# Altium project rgb_card.PrjPcb (part 4 of 4)

## Sheet modem.SchDoc
size A3
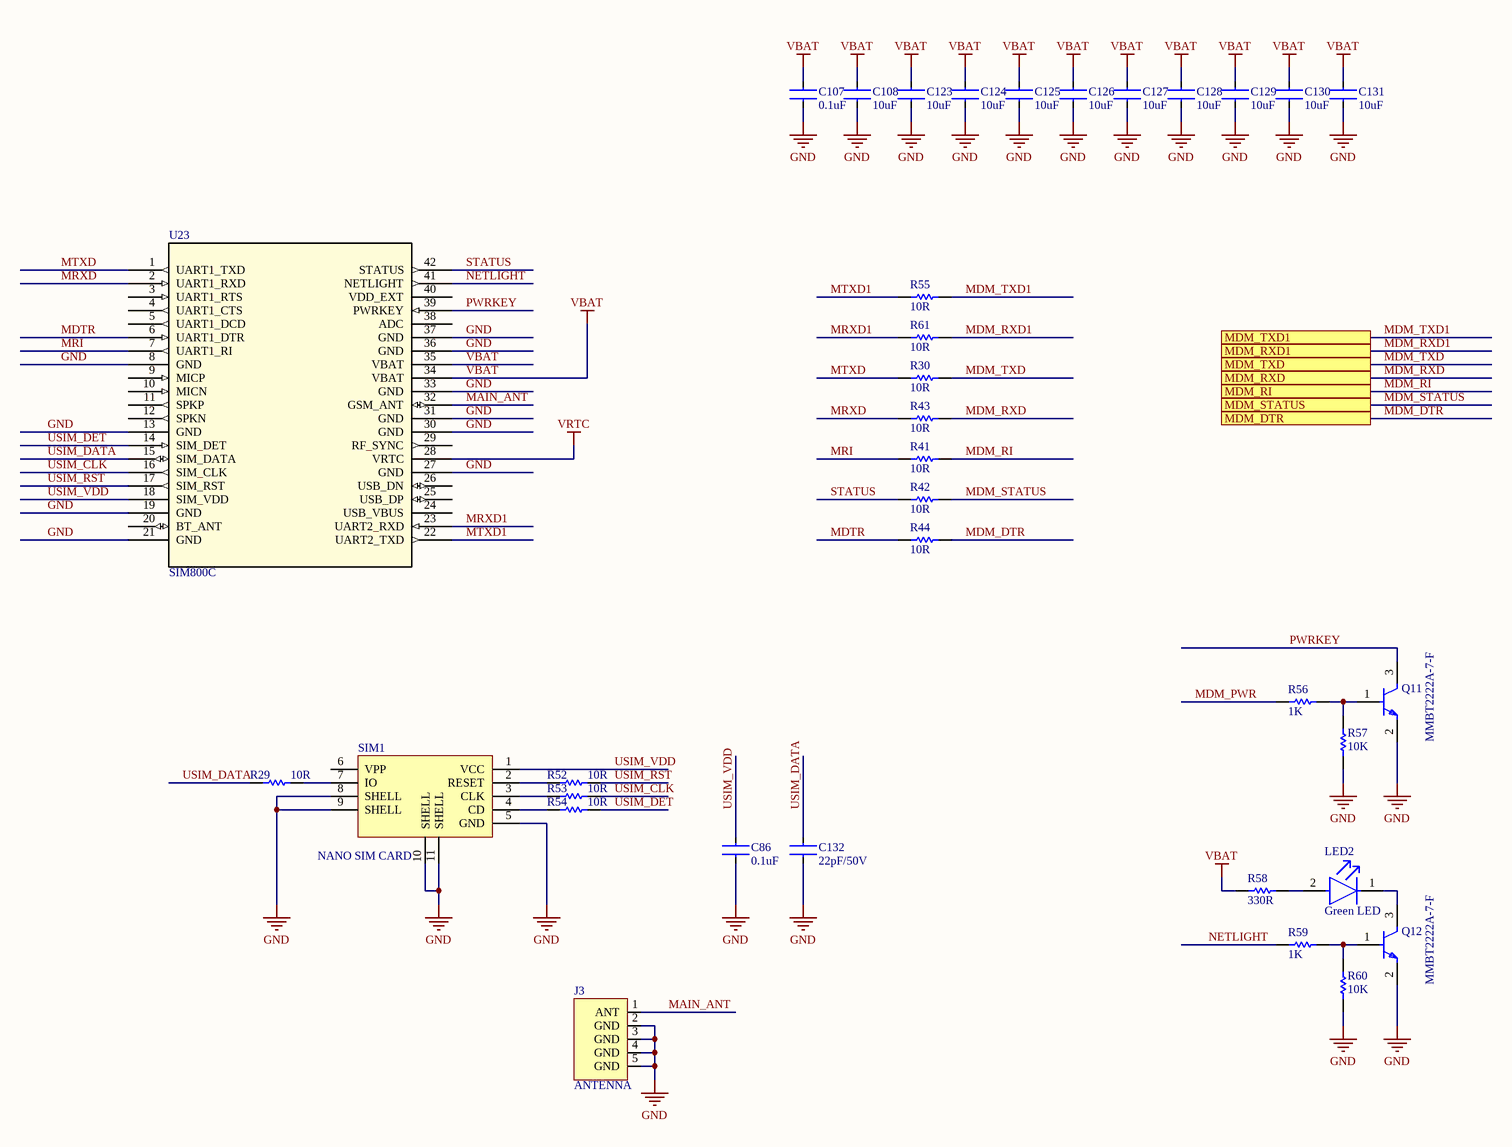
[diagram p11: modem.SchDoc]

### Parts
C86  0.1uF  [C0402]
C107  0.1uF  [C0402]
C108  10uF  [C0402]
C123  10uF  [C0402]
C124  10uF  [C0402]
C125  10uF  [C0402]
C126  10uF  [C0402]
C127  10uF  [C0402]
C128  10uF  [C0402]
C129  10uF  [C0402]
C130  10uF  [C0402]
C131  10uF  [C0402]
C132  22pF/50V  [C0402]
J3  ANTENNA  [Antenna]
LED2  Green LED  [SMD_LED_1206]
Q11  MMBT2222A-7-F  [SOT-23-3L_AOS]
Q12  MMBT2222A-7-F  [SOT-23-3L_AOS]
R29  10R  [R0402]
R30  10R  [R0402]
R41  10R  [R0402]
R42  10R  [R0402]
R43  10R  [R0402]
R44  10R  [R0402]
R52  10R  [R0402]
R53  10R  [R0402]
R54  10R  [R0402]
R55  10R  [R0402]
R56  1K  [R0402]
R57  10K  [R0402]
R58  330R  [R0402]
R59  1K  [R0402]
R60  10K  [R0402]
R61  10R  [R0402]
SIM1  NANO SIM CARD  [Nano Sim]
U23  SIM800C  [SIM800C_SMM]

### Ports
MDM_DTR, MDM_RI, MDM_RXD, MDM_RXD1, MDM_STATUS, MDM_TXD, MDM_TXD1

### Nets
GND: C86.2 C107.2 C108.2 C123.2 C124.2 C125.2 C126.2 C127.2 C128.2 C129.2 C130.2 C131.2 C132.2 J3.2(GND) J3.3(GND) J3.4(GND) J3.5(GND) Q11.2(E) Q12.2(E) R57.1 R60.1 SIM1.5(GND) SIM1.8(SHELL) SIM1.9(SHELL) SIM1.10(SHELL) SIM1.11(SHELL) U23.8(GND) U23.13(GND) U23.19(GND) U23.21(GND) U23.27(GND) U23.30(GND) U23.31(GND) U23.33(GND) U23.36(GND) U23.37(GND)
VBAT: C107.1 C108.1 C123.1 C124.1 C125.1 C126.1 C127.1 C128.1 C129.1 C130.1 C131.1 R58.1 U23.34(VBAT) U23.35(VBAT)
VRTC: U23.28(VRTC)
MAIN_ANT: J3.1(ANT) U23.32(GSM_ANT)
MDM_DTR: R44.2 ; port MDM_DTR
MDM_PWR: R56.1
MDM_RI: R41.2 ; port MDM_RI
MDM_RXD: R43.2 ; port MDM_RXD
MDM_RXD1: R61.2 ; port MDM_RXD1
MDM_STATUS: R42.2 ; port MDM_STATUS
MDM_TXD: R30.2 ; port MDM_TXD
MDM_TXD1: R55.2 ; port MDM_TXD1
MDTR: R44.1 U23.6(UART1_DTR)
MRI: R41.1 U23.7(UART1_RI)
MRXD: R43.1 U23.2(UART1_RXD)
MRXD1: R61.1 U23.23(UART2_RXD)
MTXD: R30.1 U23.1(UART1_TXD)
MTXD1: R55.1 U23.22(UART2_TXD)
NETLIGHT: R59.1 U23.41(NETLIGHT)
PWRKEY: Q11.3(C) U23.39(PWRKEY)
STATUS: R42.1 U23.42(STATUS)
USIM_CLK: R53.2 U23.16(SIM_CLK)
USIM_DATA: C132.1 R29.1 U23.15(SIM_DATA)
USIM_DET: R54.2 U23.14(SIM_DET)
USIM_RST: R52.2 U23.17(SIM_RST)
USIM_VDD: C86.1 SIM1.1(VCC) U23.18(SIM_VDD)
NetLED2_1: LED2.1(C) Q12.3(C)
NetLED2_2: LED2.2(A) R58.2
NetQ11_1: Q11.1(B) R56.2 R57.2
NetQ12_1: Q12.1(B) R59.2 R60.2
NetR29_2: R29.2 SIM1.7(IO)
NetR52_1: R52.1 SIM1.2(RESET)
NetR53_1: R53.1 SIM1.3(CLK)
NetR54_1: R54.1 SIM1.4(CD)

Not connected (* = marked no-connect by the designer): SIM1 6(VPP); U23 3(UART1_RTS) 4(UART1_CTS) 5(UART1_DCD) 9(MICP) 10(MICN) 11(SPKP) 12(SPKN) 20(BT_ANT) 24(USB_VBUS) 25(USB_DP) 26(USB_DN) 29(RF_SYNC) 38(ADC) 40(VDD_EXT)

### Library data of the parts
C86 C107 = CL31B104KBCNNNC: Ceramic capacitor SMD-1206 100nF /50V X7R# K +-10%, Samsung, RoHS; Tolerance: 10%; Dielectric: X7R; Voltage: 50V; Supplier 1: Arrow Electronics; Manufacturer: Samsung; Manufacturer Part Number: CL31B104KBCNNNC; RoHS: Yes; Category: Ceramic Capacitors; Stock 1: 3508000; Pricing 1: 4000=0.02060, 8000=0.01660 (USD); Mount: Surface Mount; Case/Package: 1206; Case Code (Metric): 3216; Case Code (Imperial): 1206; Material: Ceramic; Contact Plating: Tin; Min Operating Temperature: -55°C; Max Operating Temperature: 125°C; Capacitance: 100nF; Voltage Rating (DC): 50V; Packaging: Tape and Reel; Voltage Rating: 50V; Series: CL; Length: 3.2mm; Width: 0.063inch; Height: 0.85mm; Depth: 1.6mm; Thickness: 0.037inch; Radiation Hardening: No; Lead Free: Lead Free; RoHS Compliant: Yes; ComponentLink1URL: https://datasheet.ciiva.com/25710/cl31b104kbcnnnc-25710293.pdf?src-supplier=Digi-Key; ComponentLink1Description: https://datasheet.ciiva.com/25710/cl31b104kbcnnnc-25710293.pdf?src-supplier=Digi-Key; ComponentLink2URL: https://datasheet.ciiva.com/29201/451941-da-01-en-vs-kondensator-1206-29201689.pdf?src-supplier=Conrad; ComponentLink2Description: https://datasheet.ciiva.com/29201/451941-da-01-en-vs-kondensator-1206-29201689.pdf?src-supplier=Conrad; ComponentLink3URL: https://datasheet.ciiva.com/16298/cl05b104kq5nnnc-16298186.pdf?src-supplier=Future+Electronics; ComponentLink3Description: https://datasheet.ciiva.com/16298/cl05b104kq5nnnc-16298186.pdf?src-supplier=Future+Electronics; Supplier Part Number 1: CL31B104KBCNNNC
C108 C123-C131 = CL31B106KOHNNNE: Cap Ceramic 10uF 16V X7R 10% Pad SMD 1206 125°C T/R; Manufacturer: Samsung; Supplier 1: Future Electronics; Manufacturer Part Number: CL31B106KOHNNNE; RoHS: Yes; Category: Ceramic Capacitors; Stock 1: 116000; Pricing 1: 2000=0.03800, 6000=0.03460, 8000=0.03450, 20000=0.03420, 30000=0.03400 (USD); Mount: Surface Mount; Case/Package: 1206; Case Code (Metric): 3216; Case Code (Imperial): 1206; Material: Ceramic; Contact Plating: Tin; Min Operating Temperature: -55°C; Max Operating Temperature: 125°C; Capacitance: 10uF; Tolerance: 10%; Dielectric: X7R; Package Quantity: 1; Packaging: Tape and Reel; Voltage Rating: 16V; Series: CL; Length: 3.2mm; Width: 0.063inch; Height: 1.6mm; Thickness: 0.071inch; Depth: 1.6mm; RoHS Compliant: Yes; ComponentLink1URL: https://datasheet.ciiva.com/25795/cl31b106kohnnne-25795201.pdf?src-supplier=Digi-Key; ComponentLink1Description: https://datasheet.ciiva.com/25795/cl31b106kohnnne-25795201.pdf?src-supplier=Digi-Key; ComponentLink2URL: https://datasheet.ciiva.com/29201/452535-da-01-en-vs-kondensator-1206-29201132.pdf?src-supplier=Conrad; ComponentLink2Description: https://datasheet.ciiva.com/29201/452535-da-01-en-vs-kondensator-1206-29201132.pdf?src-supplier=Conrad; Supplier Part Number 1: 2558872
C132 = CL31C220JBCNNNC: Cap Ceramic 22pF 50V C0G 5% SMD 1206 125°C Paper T/R; Manufacturer: Samsung; Temperature Coefficient: 300ppm/°C; Supplier 1: Arrow Electronics; Manufacturer Part Number: CL31C220JBCNNNC; RoHS: Yes; Category: Ceramic Capacitors; Stock 1: 470; Pricing 1: 1=0.13340, 10=0.08580, 25=0.08490, 100=0.04720, 250=0.04670 (USD); Mount: Surface Mount; Case/Package: 1206; Case Code (Metric): 3216; Case Code (Imperial): 1206; Material: Ceramic; Min Operating Temperature: -55°C; Max Operating Temperature: 125°C; Capacitance: 22pF; Tolerance: 5%; Dielectric: C0G; Voltage Rating: 50V; Package Quantity: 1; Packaging: Tape and Reel; Voltage: 50V; Voltage Rating (DC): 50V; Series: CL; Construction: Flat; Length: 3.2mm; Width: 0.063inch; Height: 0.85mm; Depth: 1.6mm; Thickness: 0.039inch; Radiation Hardening: No; Lead Free: Lead Free; RoHS Compliant: Yes; ComponentLink1URL: https://datasheet.ciiva.com/25799/cl31c220jbcnnnc-25799089.pdf?src-supplier=Digi-Key; ComponentLink1Description: https://datasheet.ciiva.com/25799/cl31c220jbcnnnc-25799089.pdf?src-supplier=Digi-Key; ComponentLink2URL: https://datasheet.ciiva.com/29201/452314-da-01-en-vs-kondensator-1206-29201377.pdf?src-supplier=Conrad; ComponentLink2Description: https://datasheet.ciiva.com/29201/452314-da-01-en-vs-kondensator-1206-29201377.pdf?src-supplier=Conrad; Supplier Part Number 1: CL31C220JBCNNNC
LED2 = LTST-C150GKT: LED GREEN CLEAR 1206 SMD; Manufacturer: Vishay Lite-On; Lens Color: Colorless; Lens Style: Diffused,Colorless,Rectangular,Clear; Number of LEDs: 1; Luminous Intensity: 6mcd; Forward Voltage: 2.1V; Test Current: 10mA; Wavelength: 565nm; Reverse Voltage: 5V; Forward Current: 30mA; Viewing Angle: 130°; Power Rating: 100mW; Dominant Wavelength: 569nm; Supplier 1: Rutronik; Manufacturer Part Number: LTST-C150GKT; RoHS: Yes; Category: LEDs; Stock 1: 5; Pricing 1: 9000=0.04160, 18000=0.04120, 27000=0.04120 (USD); Mount: Surface Mount; Case/Package: 1206; Number of Pins: 2; Color: Green; Case Code (Metric): 3216; Case Code (Imperial): 1206; Min Operating Temperature: -55°C; Max Operating Temperature: 85°C; Packaging: Tape and Reel; Package Quantity: 1; Illumination Color: Green; Lens Transparency: Clear; Number of Elements: 1; Power Dissipation: 100mW; Series: CHIPLED 1206; Max Power Dissipation: 100mW; Length: 3.2mm; Width: 1.6mm; Height: 1.1mm; Depth: 1.6mm; Radiation Hardening: No; Lead Free: Lead Free; RoHS Compliant: Yes; ComponentLink1URL: https://datasheet.ciiva.com/2110/ltst-c150gkt-2110032.pdf?src-supplier=Digi-Key; ComponentLink1Description: https://datasheet.ciiva.com/2110/ltst-c150gkt-2110032.pdf?src-supplier=Digi-Key; ComponentLink2URL: https://datasheet.ciiva.com/11775/0900766b80dc0263-11775637.pdf?src-supplier=RSComponents; ComponentLink2Description: https://datasheet.ciiva.com/11775/0900766b80dc0263-11775637.pdf?src-supplier=RSComponents; ComponentLink3URL: https://datasheet.ciiva.com/12400/lite-on-ltst-c150gkt-187412-12400912.pdf?src-supplier=Mouser; ComponentLink3Description: https://datasheet.ciiva.com/12400/lite-on-ltst-c150gkt-187412-12400912.pdf?src-supplier=Mouser; ComponentLink4URL: https://datasheet.ciiva.com/4266/s-110-ltst-c150gkt-4266310.pdf?src-supplier=Arrow+Electronics; ComponentLink4Description: https://datasheet.ciiva.com/4266/s-110-ltst-c150gkt-4266310.pdf?src-supplier=Arrow+Electronics; ComponentLink5URL: https://datasheet.ciiva.com/16375/ltst-c150gkt-16375926.pdf?src-supplier=Future+Electronics; ComponentLink5Description: https://datasheet.ciiva.com/16375/ltst-c150gkt-16375926.pdf?src-supplier=Future+Electronics; ComponentLink6URL: https://datasheet.ciiva.com/15117/getdatasheetpartid-142080-15117739.pdf?src-supplier=Verical; ComponentLink6Description: https://datasheet.ciiva.com/15117/getdatasheetpartid-142080-15117739.pdf?src-supplier=Verical; Supplier Part Number 1: LED6762
Q11 Q12 = MMBT2222A-7-F: NPN Ic=600mA Vceo=40V hfe=100~300 fT=300MHz P=310mW SOT-23; Manufacturer: Diodes; hFE Min: 100; Frequency: 300MHz; Max Power Dissipation: 300mW; Number of Elements: 1; Collector Emitter Voltage (VCEO): 40V; Collector Base Voltage (VCBO): 75V; Emitter Base Voltage (VEBO): 6V; Collector Emitter Saturation Voltage: 1V; Max Collector Current: 600mA; Power Dissipation: 350mW; Element Configuration: Single; Current: 1A; Supplier 1: RSComponents; Manufacturer Part Number: MMBT2222A-7-F; RoHS: Yes; Category: BJTs; Stock 1: 3000; Pricing 1: 3000=0.02700, 6000=0.02500, 12000=0.02400, 30000=0.02300, 60000=0.02100 (USD); Mount: Surface Mount; Case/Package: SOT-23; Number of Pins: 3; Weight: 0.000282oz; Contact Plating: Tin,Matte; Min Operating Temperature: -55°C; Max Operating Temperature: 150°C; Polarity: NPN; Packaging: Tape and Reel; Package Quantity: 3000; Continuous Collector Current: 600mA; Collector Emitter Breakdown Voltage: 40V; Transition Frequency: 300MHz; Max Breakdown Voltage: 40V; Max Frequency: 300MHz; Termination: SMD/SMT; Gain Bandwidth Product: 300MHz; Voltage Rating (DC): 40V; Current Rating: 600mA; Voltage: 40V; Collector-emitter Voltage-Max: 1V; Series: -; Length: 3.05mm; Width: 1.4mm; Height: 1mm; Radiation Hardening: No; REACH SVHC: No SVHC; Lead Free: Lead Free; RoHS Compliant: Yes; ComponentLink1URL: https://datasheet.ciiva.com/15139/getdatasheetpartid-82692-15139078.pdf?src-supplier=Verical; ComponentLink1Description: https://datasheet.ciiva.com/15139/getdatasheetpartid-82692-15139078.pdf?src-supplier=Verical; ComponentLink2URL: https://datasheet.ciiva.com/8029/ds30041-8029709.pdf?src-supplier=Element14; ComponentLink2Description: https://datasheet.ciiva.com/8029/ds30041-8029709.pdf?src-supplier=Element14; ComponentLink3URL: https://datasheet.ciiva.com/11201/ds30041-11201864.pdf?src-supplier=Avnet; ComponentLink3Description: https://datasheet.ciiva.com/11201/ds30041-11201864.pdf?src-supplier=Avnet; ComponentLink4URL: https://datasheet.ciiva.com/16199/ds30041-16199045.pdf?src-supplier=Future+Electronics; ComponentLink4Description: https://datasheet.ciiva.com/16199/ds30041-16199045.pdf?src-supplier=Future+Electronics; ComponentLink5URL: https://datasheet.ciiva.com/11198/ds30041-11198965.pdf?src-supplier=Avnet; ComponentLink5Description: https://datasheet.ciiva.com/11198/ds30041-11198965.pdf?src-supplier=Avnet; ComponentLink6URL: https://datasheet.ciiva.com/972/ds30041-972551.pdf?src-supplier=Digi-Key; ComponentLink6Description: https://datasheet.ciiva.com/972/ds30041-972551.pdf?src-supplier=Digi-Key; ComponentLink7URL: https://datasheet.ciiva.com/972/ds30041-972552.pdf?src-supplier=Digi-Key; ComponentLink7Description: https://datasheet.ciiva.com/972/ds30041-972552.pdf?src-supplier=Digi-Key; ComponentLink8URL: https://datasheet.ciiva.com/972/ds30041-972550.pdf?src-supplier=Digi-Key; ComponentLink8Description: https://datasheet.ciiva.com/972/ds30041-972550.pdf?src-supplier=Digi-Key; Supplier Part Number 1: 1219442
R29 R30 R41-R44 R52-R55 R61 = RC1206FR-0710RL: Res Thick Film 1206 10 Ohm 1% 0.25W(1/4W) +/-200ppm/ßC Epoxy SMD T/R; Manufacturer: Yageo; Temperature Coefficient: 200ppm/°C; Voltage Rating (DC): 200V; Power Rating: 250mW; Supplier 1: Arrow Electronics; Manufacturer Part Number: RC1206FR-0710RL; RoHS: Yes; Category: Chip SMD Resistors; Stock 1: 60000; Pricing 1: 5000=0.02280 (USD); Case/Package: 1206; Number of Pins: 2; Case Code (Metric): 3216; Case Code (Imperial): 1206; Size Code: 1206; Min Operating Temperature: -55°C; Max Operating Temperature: 155°C; Tolerance: 1%; Resistance: 10R; Resistor Type: Thick Film; Packaging: Tape and Reel; Package Quantity: 1; Voltage Rating: 200V; Number of Terminations: 2; Termination: SMD/SMT; Max Power Dissipation: 250mW; Features: Moisture Resistant; Series: RC; Resistance Tolerance: 1%; Technology: THICK FILM; Construction: Rectangular; Length: 3.1mm; Width: 0.063inch; Height: 0.026inch; Depth: 1.6mm; REACH SVHC: Unknown; Lead Free: Lead Free; Military Standard: Not; RoHS Compliant: Yes; ComponentLink1URL: https://datasheet.ciiva.com/11819/0900766b80c6630a-11819896.pdf?src-supplier=RSComponents; ComponentLink1Description: https://datasheet.ciiva.com/11819/0900766b80c6630a-11819896.pdf?src-supplier=RSComponents; ComponentLink2URL: https://datasheet.ciiva.com/22735/444357-22735648.pdf?src-supplier=Farnell; ComponentLink2Description: https://datasheet.ciiva.com/22735/444357-22735648.pdf?src-supplier=Farnell; ComponentLink3URL: https://datasheet.ciiva.com/29181/402303-da-01-en-smd-widerstand-chip1206-10-ohm-29181572.pdf?src-supplier=Conrad; ComponentLink3Description: https://datasheet.ciiva.com/29181/402303-da-01-en-smd-widerstand-chip1206-10-ohm-29181572.pdf?src-supplier=Conrad; ComponentLink4URL: https://datasheet.ciiva.com/46445/444357-46445704.pdf?src-supplier=Element14; ComponentLink4Description: https://datasheet.ciiva.com/46445/444357-46445704.pdf?src-supplier=Element14; ComponentLink5URL: https://datasheet.ciiva.com/2460/pyu-rc1206-51-rohs-l-4-2460049.pdf?src-supplier=Digi-Key; ComponentLink5Description: https://datasheet.ciiva.com/2460/pyu-rc1206-51-rohs-l-4-2460049.pdf?src-supplier=Digi-Key; ComponentLink6URL: https://datasheet.ciiva.com/2460/pyu-rc1206-51-rohs-l-4-2460050.pdf?src-supplier=Digi-Key; ComponentLink6Description: https://datasheet.ciiva.com/2460/pyu-rc1206-51-rohs-l-4-2460050.pdf?src-supplier=Digi-Key; ComponentLink7URL: https://datasheet.ciiva.com/2460/pyu-rc1206-51-rohs-l-4-2460048.pdf?src-supplier=Digi-Key; ComponentLink7Description: https://datasheet.ciiva.com/2460/pyu-rc1206-51-rohs-l-4-2460048.pdf?src-supplier=Digi-Key; ComponentLink8URL: https://datasheet.ciiva.com/16962/pyu-rc1206-51-rohs-l-4-16962857.pdf?src-supplier=Future+Electronics; ComponentLink8Description: https://datasheet.ciiva.com/16962/pyu-rc1206-51-rohs-l-4-16962857.pdf?src-supplier=Future+Electronics; Supplier Part Number 1: RC1206FR-0710RL
R56 R59 = RC1206FR-071KL: In a Pack of 5000, 1K 1206 Thick Film SMD Resistor ±1% 0.25W - RC1206FR-071KL; Manufacturer: Yageo; Resistance: 1kR; Power Rating: 250mW; Voltage Rating: 200V; Temperature Coefficient: 100ppm/°C; Supplier 1: Arrow Electronics; Manufacturer Part Number: RC1206FR-071KL; RoHS: Yes; Category: Chip SMD Resistors; Stock 1: 535000; Pricing 1: 5000=0.00940, 10000=0.00890 (USD); Case/Package: 1206; Case Code (Imperial): 1206; Case Code (Metric): 3216; Size Code: 1206; Min Operating Temperature: -55°C; Max Operating Temperature: 155°C; Tolerance: 1%; Packaging: Tape and Reel; Resistor Type: Thick Film; Termination: SMD/SMT; Series: RC; Resistance Tolerance: 1%; Construction: Rectangular; Technology: THICK FILM; Length: 3.1mm; Height: 0.55mm; Depth: 1.6mm; REACH SVHC: Unknown; Military Standard: Not; Lead Free: Lead Free; RoHS Compliant: Yes; ComponentLink1URL: https://datasheet.ciiva.com/11808/0900766b80c6630a-11808217.pdf?src-supplier=RSComponents; ComponentLink1Description: https://datasheet.ciiva.com/11808/0900766b80c6630a-11808217.pdf?src-supplier=RSComponents; ComponentLink2URL: https://datasheet.ciiva.com/29181/402540-da-01-en-smd-widerstand-chip1206-1-kohm-29181462.pdf?src-supplier=Conrad; ComponentLink2Description: https://datasheet.ciiva.com/29181/402540-da-01-en-smd-widerstand-chip1206-1-kohm-29181462.pdf?src-supplier=Conrad; ComponentLink3URL: https://datasheet.ciiva.com/46445/444357-46445708.pdf?src-supplier=Element14; ComponentLink3Description: https://datasheet.ciiva.com/46445/444357-46445708.pdf?src-supplier=Element14; Supplier Part Number 1: RC1206FR-071KL
R57 R60 = RC1206FR-0710KL: Res Thick Film 1206 10K Ohm 1% 0.25W(1/4W) ±100ppm/C Pad SMD T/R; Manufacturer: Yageo; Resistance: 10kR; Temperature Coefficient: 100ppm/°C; Power Rating: 250mW; Voltage Rating: 200V; Supplier 1: Arrow Electronics; Manufacturer Part Number: RC1206FR-0710KL; RoHS: Yes; Category: Chip SMD Resistors; Stock 1: 10000; Pricing 1: 5000=0.00970 (USD); Case/Package: 1206; Case Code (Imperial): 1206; Case Code (Metric): 3216; Size Code: 1206; Min Operating Temperature: -55°C; Max Operating Temperature: 155°C; Tolerance: 1%; Packaging: Tape and Reel; Resistor Type: Thick Film; Package Quantity: 5000; Termination: SMD/SMT; Features: Moisture Resistant; Series: RC; Max Power Dissipation: 250mW; Number of Terminations: 2; Resistance Tolerance: 1%; Construction: Rectangular; Length: 3.1mm; Width: 1.6mm; Height: 0.55mm; Depth: 1.6mm; REACH SVHC: Unknown; Lead Free: Lead Free; Military Standard: Not; RoHS Compliant: Yes; ComponentLink1URL: https://datasheet.ciiva.com/46445/444357-46445703.pdf?src-supplier=Element14; ComponentLink1Description: https://datasheet.ciiva.com/46445/444357-46445703.pdf?src-supplier=Element14; ComponentLink2URL: https://datasheet.ciiva.com/7857/1692832-7857244.pdf?src-supplier=Element14; ComponentLink2Description: https://datasheet.ciiva.com/7857/1692832-7857244.pdf?src-supplier=Element14; ComponentLink3URL: https://datasheet.ciiva.com/7857/1692832-7857245.pdf?src-supplier=Element14; ComponentLink3Description: https://datasheet.ciiva.com/7857/1692832-7857245.pdf?src-supplier=Element14; Supplier Part Number 1: RC1206FR-0710KL
R58 = RC1206FR-07330RL: Res Thick Film 1206 330 Ohm 1% 0.25W(1/4W) ±100ppm/°C Pad SMD T/R; Manufacturer: Yageo; Power Rating: 250mW; Voltage Rating: 200V; Supplier 1: Arrow Electronics; Manufacturer Part Number: RC1206FR-07330RL; RoHS: Yes; Category: Chip SMD Resistors; Stock 1: 4745; Pricing 1: 1=0.07520, 10=0.04740, 25=0.04700, 100=0.02480, 250=0.02450, 500=0.02430, 1000=0.02280, 3000=0.01110 (USD); Case/Package: 1206; Case Code (Imperial): 1206; Case Code (Metric): 3216; Size Code: 1206; Min Operating Temperature: -55°C; Max Operating Temperature: 155°C; Tolerance: 1%; Resistance: 330R; Resistor Type: Thick Film; Packaging: Tape and Reel; Termination: SMD/SMT; Temperature Coefficient: 100ppm/°C; Features: Moisture Resistant; Series: RC; Max Power Dissipation: 250mW; Number of Terminations: 2; Technology: THICK FILM; Resistance Tolerance: 1%; Length: 3.1mm; Height: 0.55mm; Depth: 1.6mm; RoHS Compliant: Yes; REACH SVHC: Unknown; Lead Free: Lead Free; ComponentLink1URL: https://datasheet.ciiva.com/11819/0900766b80c6630a-11819921.pdf?src-supplier=RSComponents; ComponentLink1Description: https://datasheet.ciiva.com/11819/0900766b80c6630a-11819921.pdf?src-supplier=RSComponents; ComponentLink2URL: https://datasheet.ciiva.com/17422/pyu-rc1206-51-rohs-l-4-17422588.pdf?src-supplier=Future+Electronics; ComponentLink2Description: https://datasheet.ciiva.com/17422/pyu-rc1206-51-rohs-l-4-17422588.pdf?src-supplier=Future+Electronics; Supplier Part Number 1: RC1206FR-07330RL
SIM1 = Nano sim
U23 = SIM800C: No Description Available; Mfr_Name: Simcom; Copyright: Copyright (C) 2022 Ultra Librarian. All rights reserved.; Manufacturer_Part_Number: SIM800C; RefDes: RefDes; Type: DEV

## Sheet ethernet.SchDoc
size A
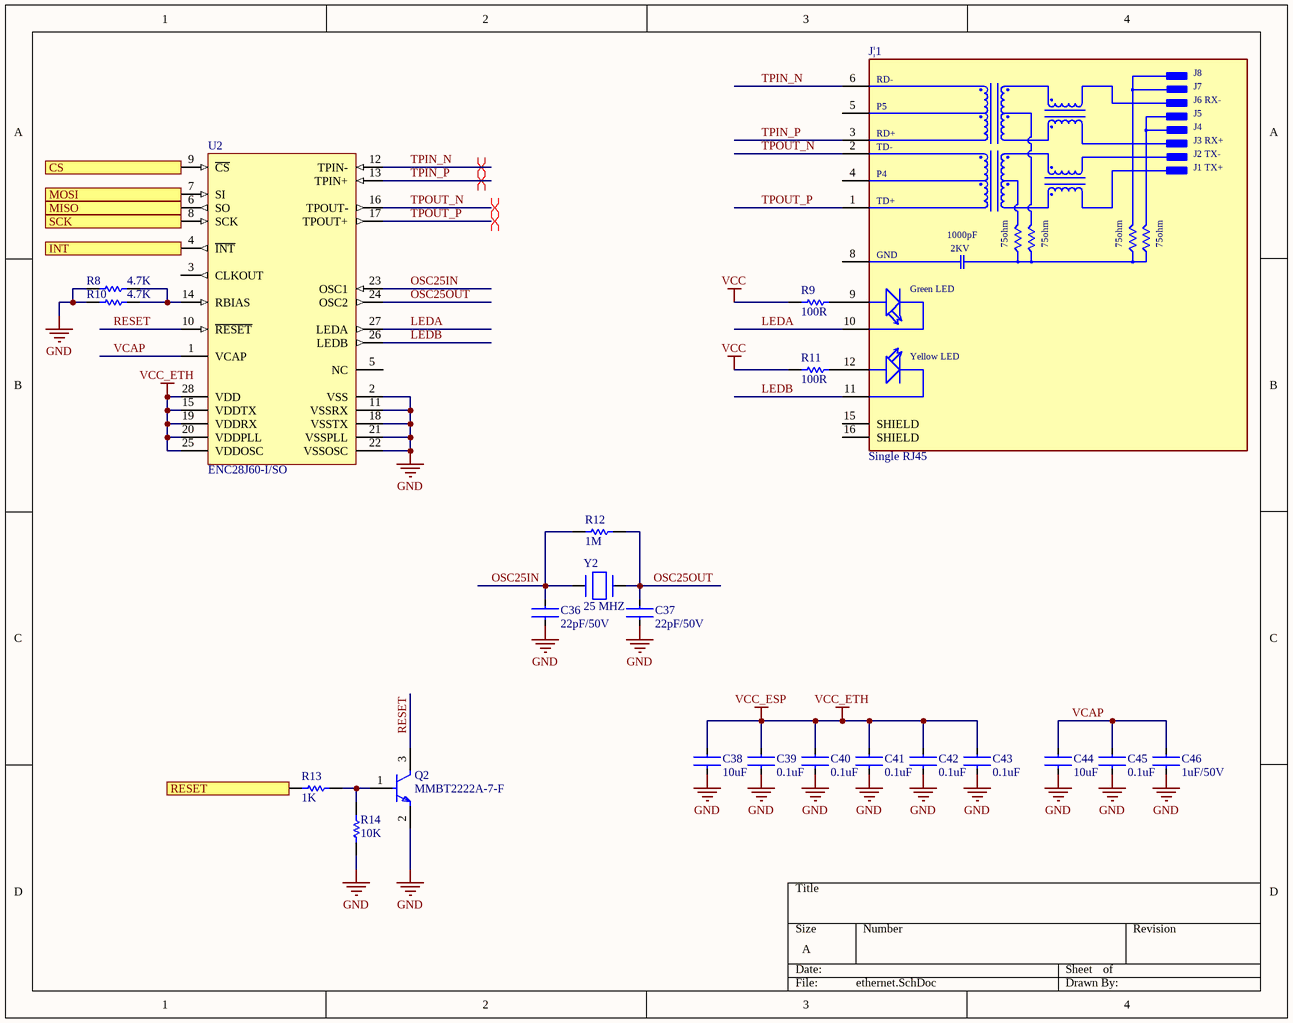
[diagram p12: ethernet.SchDoc]

### Parts
C36  22pF/50V  [C0402]
C37  22pF/50V  [C0402]
C38  10uF  [C0402]
C39  0.1uF  [C0402]
C40  0.1uF  [C0402]
C41  0.1uF  [C0402]
C42  0.1uF  [C0402]
C43  0.1uF  [C0402]
C44  10uF  [C0402]
C45  0.1uF  [C0402]
C46  1uF/50V  [C0402]
J|1  Single RJ45  [HANRUN_HR911105A]
Q2  MMBT2222A-7-F  [Diodes_SOT23_IPC_B]
R8  4.7K  [R0402]
R9  100R  [R0402]
R10  4.7K  [R0402]
R11  100R  [R0402]
R12  1M  [R0402]
R13  1K  [R0402]
R14  10K  [R0402]
U2  ENC28J60-I/SO  [SOIC-SO28_N]
Y2  25 MHZ  [CTS_ATS080B_0]

### Ports
CS, INT, MISO, MOSI, RESET, SCK

### Nets
GND: C36.2 C37.2 C38.2 C39.2 C40.2 C41.2 C42.2 C43.2 C44.2 C45.2 C46.2 Q2.2(E) R8.1 R10.1 R14.1 U2.2(VSS) U2.11(VSSRX) U2.18(VSSTX) U2.21(VSSPLL) U2.22(VSSOSC)
VCC: R9.1 R11.1
VCC_ESP: C38.1 C39.1 C40.1 C41.1 C42.1 C43.1 U2.15(VDDTX) U2.19(VDDRX) U2.20(VDDPLL) U2.25(VDDOSC) U2.28(VDD)  [also labelled VCC_ETH]  [project net ETH_VCC]
LEDA: J|1.10(GC) U2.27(LEDA)
LEDB: J|1.11(YC) U2.26(LEDB)
OSC25IN: C36.1 R12.1 U2.23(OSC1) Y2.1
OSC25OUT: C37.1 R12.2 U2.24(OSC2) Y2.2
RESET: Q2.3(C) U2.10(~{RESET})
TPIN_N: J|1.6(RD-) U2.12(TPIN-)
TPIN_P: J|1.3(RD+) U2.13(TPIN+)
TPOUT_N: J|1.2(TD-) U2.16(TPOUT-)
TPOUT_P: J|1.1(TD+) U2.17(TPOUT+)
VCAP: C44.1 C45.1 C46.1 U2.1(VCAP)
NetJ|1_9: J|1.9(GA) R9.2
NetJ|1_12: J|1.12(YA) R11.2
NetQ2_1: Q2.1(B) R13.2 R14.2
NetR8_2: R8.2 R10.2 U2.14(RBIAS)
NetR13_1: R13.1 ; port RESET
NetU2_4: U2.4(~{INT}) ; port INT
NetU2_6: U2.6(SO) ; port MISO
NetU2_7: U2.7(SI) ; port MOSI
NetU2_8: U2.8(SCK) ; port SCK
NetU2_9: U2.9(~{CS}) ; port CS

Not connected (* = marked no-connect by the designer): J|1 4(P4) 5(P5) 8(GND) 15(SHIELD) 16(SHIELD); U2 3(CLKOUT) 5(NC)

### Layout directives
differential pair: TPIN_N, TPIN_P, TPOUT_N, TPOUT_P

### Notes on the sheet
- (in symbol HR911105A) J8; J7; J6 RX-; J5; J4; J3 RX+; J2 TX-; J1 TX+; 1000pF; 75ohm; 2KV; Green LED; Yellow LED

### Library data of the parts
C36 C37 = CL31C220JBCNNNC: as C132 on sheet modem; Supplier 1: Arrow Electronics; Manufacturer Part Number: CL31C220JBCNNNC; RoHS: Yes; Category: Ceramic Capacitors; Stock 1: 470; Pricing 1: 1=0.13340, 10=0.08580, 25=0.08490, 100=0.04720, 250=0.04670 (USD); Mount: Surface Mount; Case/Package: 1206; Case Code (Metric): 3216; Case Code (Imperial): 1206; Material: Ceramic; Min Operating Temperature: -55°C; Max Operating Temperature: 125°C; Capacitance: 22pF; Tolerance: 5%; Dielectric: C0G; Voltage Rating: 50V; Package Quantity: 1; Packaging: Tape and Reel; Voltage: 50V; Voltage Rating (DC): 50V; Series: CL; Construction: Flat; Length: 3.2mm; Width: 0.063inch; Height: 0.85mm; Depth: 1.6mm; Thickness: 0.039inch; Radiation Hardening: No; Lead Free: Lead Free; RoHS Compliant: Yes; ComponentLink1URL: https://datasheet.ciiva.com/25799/cl31c220jbcnnnc-25799089.pdf?src-supplier=Digi-Key; ComponentLink1Description: https://datasheet.ciiva.com/25799/cl31c220jbcnnnc-25799089.pdf?src-supplier=Digi-Key; ComponentLink2URL: https://datasheet.ciiva.com/29201/452314-da-01-en-vs-kondensator-1206-29201377.pdf?src-supplier=Conrad; ComponentLink2Description: https://datasheet.ciiva.com/29201/452314-da-01-en-vs-kondensator-1206-29201377.pdf?src-supplier=Conrad; Supplier Part Number 1: CL31C220JBCNNNC
C38 C44 = CL31B106KOHNNNE: as C108 on sheet modem; Supplier 1: Future Electronics; Manufacturer Part Number: CL31B106KOHNNNE; RoHS: Yes; Category: Ceramic Capacitors; Stock 1: 116000; Pricing 1: 2000=0.03800, 6000=0.03460, 8000=0.03450, 20000=0.03420, 30000=0.03400 (USD); Mount: Surface Mount; Case/Package: 1206; Case Code (Metric): 3216; Case Code (Imperial): 1206; Material: Ceramic; Contact Plating: Tin; Min Operating Temperature: -55°C; Max Operating Temperature: 125°C; Capacitance: 10uF; Tolerance: 10%; Dielectric: X7R; Package Quantity: 1; Packaging: Tape and Reel; Voltage Rating: 16V; Series: CL; Length: 3.2mm; Width: 0.063inch; Height: 1.6mm; Thickness: 0.071inch; Depth: 1.6mm; RoHS Compliant: Yes; ComponentLink1URL: https://datasheet.ciiva.com/25795/cl31b106kohnnne-25795201.pdf?src-supplier=Digi-Key; ComponentLink1Description: https://datasheet.ciiva.com/25795/cl31b106kohnnne-25795201.pdf?src-supplier=Digi-Key; ComponentLink2URL: https://datasheet.ciiva.com/29201/452535-da-01-en-vs-kondensator-1206-29201132.pdf?src-supplier=Conrad; ComponentLink2Description: https://datasheet.ciiva.com/29201/452535-da-01-en-vs-kondensator-1206-29201132.pdf?src-supplier=Conrad; Supplier Part Number 1: 2558872
C39-C43 C45 = CL31B104KBCNNNC: as C86 on sheet modem; Supplier 1: Arrow Electronics; Manufacturer: Samsung; Manufacturer Part Number: CL31B104KBCNNNC; RoHS: Yes; Category: Ceramic Capacitors; Stock 1: 3508000; Pricing 1: 4000=0.02060, 8000=0.01660 (USD); Mount: Surface Mount; Case/Package: 1206; Case Code (Metric): 3216; Case Code (Imperial): 1206; Material: Ceramic; Contact Plating: Tin; Min Operating Temperature: -55°C; Max Operating Temperature: 125°C; Capacitance: 100nF; Voltage Rating (DC): 50V; Packaging: Tape and Reel; Voltage Rating: 50V; Series: CL; Length: 3.2mm; Width: 0.063inch; Height: 0.85mm; Depth: 1.6mm; Thickness: 0.037inch; Radiation Hardening: No; Lead Free: Lead Free; RoHS Compliant: Yes; ComponentLink1URL: https://datasheet.ciiva.com/25710/cl31b104kbcnnnc-25710293.pdf?src-supplier=Digi-Key; ComponentLink1Description: https://datasheet.ciiva.com/25710/cl31b104kbcnnnc-25710293.pdf?src-supplier=Digi-Key; ComponentLink2URL: https://datasheet.ciiva.com/29201/451941-da-01-en-vs-kondensator-1206-29201689.pdf?src-supplier=Conrad; ComponentLink2Description: https://datasheet.ciiva.com/29201/451941-da-01-en-vs-kondensator-1206-29201689.pdf?src-supplier=Conrad; ComponentLink3URL: https://datasheet.ciiva.com/16298/cl05b104kq5nnnc-16298186.pdf?src-supplier=Future+Electronics; ComponentLink3Description: https://datasheet.ciiva.com/16298/cl05b104kq5nnnc-16298186.pdf?src-supplier=Future+Electronics; Supplier Part Number 1: CL31B104KBCNNNC
C46 = CL31B105KBHNNNE: CAP CER 1UF 50V X7R 1206; Manufacturer: Samsung; Material: Ceramic; Tolerance: 10%; Supplier 1: Arrow Electronics; Manufacturer Part Number: CL31B105KBHNNNE; RoHS: Yes; Category: Ceramic Capacitors; Stock 1: 2628000; Pricing 1: 2000=0.02720, 4000=0.02450, 10000=0.02260 (USD); Mount: Surface Mount; Case/Package: 1206; Case Code (Metric): 3216; Case Code (Imperial): 1206; Contact Plating: Tin; Min Operating Temperature: -55°C; Max Operating Temperature: 125°C; Capacitance: 1uF; Dielectric: X7R; Voltage Rating: 50V; Packaging: Tape and Reel; Package Quantity: 1; Voltage: 50V; Voltage Rating (DC): 50V; Series: CL; Construction: Flat; Length: 3.2mm; Width: 0.063inch; Height: 1.6mm; Thickness: 0.071inch; Depth: 1.6mm; Radiation Hardening: No; Lead Free: Lead Free; RoHS Compliant: Yes; ComponentLink1URL: https://datasheet.ciiva.com/25729/cl31b105kbhnnne-25729445.pdf?src-supplier=Digi-Key; ComponentLink1Description: https://datasheet.ciiva.com/25729/cl31b105kbhnnne-25729445.pdf?src-supplier=Digi-Key; ComponentLink2URL: https://datasheet.ciiva.com/16330/cl31b105kbhnnne-16330112.pdf?src-supplier=Future+Electronics; ComponentLink2Description: https://datasheet.ciiva.com/16330/cl31b105kbhnnne-16330112.pdf?src-supplier=Future+Electronics; ComponentLink3URL: https://datasheet.ciiva.com/26838/getdatasheetpartid-357471-26838902.pdf?src-supplier=Verical; ComponentLink3Description: https://datasheet.ciiva.com/26838/getdatasheetpartid-357471-26838902.pdf?src-supplier=Verical; ComponentLink4URL: https://datasheet.ciiva.com/29200/453294-da-01-en-vs-kondensator-1206-29200453.pdf?src-supplier=Conrad; ComponentLink4Description: https://datasheet.ciiva.com/29200/453294-da-01-en-vs-kondensator-1206-29200453.pdf?src-supplier=Conrad; Supplier Part Number 1: CL31B105KBHNNNE
J|1 = HR911105A: HR911105A Ethernet Interface Arduino Platform Evaluation Expansion Board; MF: DFRobot; Package: None; Availability: Unavailable; MP: HR911105A; Value: *; SnapEDA_Link: https://www.snapeda.com/parts/HR911105A/DFRobot/view-part/214807/?ref=snap; Price: None
Q2 = MMBT2222A-7-F: as Q11 on sheet modem; Supplier 1: RSComponents; Manufacturer Part Number: MMBT2222A-7-F; RoHS: Yes; Category: BJTs; Stock 1: 3000; Pricing 1: 3000=0.02700, 6000=0.02500, 12000=0.02400, 30000=0.02300, 60000=0.02100 (USD); Mount: Surface Mount; Case/Package: SOT-23; Number of Pins: 3; Weight: 0.000282oz; Contact Plating: Tin,Matte; Min Operating Temperature: -55°C; Max Operating Temperature: 150°C; Polarity: NPN; Packaging: Tape and Reel; Package Quantity: 3000; Continuous Collector Current: 600mA; Collector Emitter Breakdown Voltage: 40V; Transition Frequency: 300MHz; Max Breakdown Voltage: 40V; Max Frequency: 300MHz; Termination: SMD/SMT; Gain Bandwidth Product: 300MHz; Voltage Rating (DC): 40V; Current Rating: 600mA; Voltage: 40V; Collector-emitter Voltage-Max: 1V; Series: -; Length: 3.05mm; Width: 1.4mm; Height: 1mm; Radiation Hardening: No; REACH SVHC: No SVHC; Lead Free: Lead Free; RoHS Compliant: Yes; ComponentLink1URL: https://datasheet.ciiva.com/15139/getdatasheetpartid-82692-15139078.pdf?src-supplier=Verical; ComponentLink1Description: https://datasheet.ciiva.com/15139/getdatasheetpartid-82692-15139078.pdf?src-supplier=Verical; ComponentLink2URL: https://datasheet.ciiva.com/8029/ds30041-8029709.pdf?src-supplier=Element14; ComponentLink2Description: https://datasheet.ciiva.com/8029/ds30041-8029709.pdf?src-supplier=Element14; ComponentLink3URL: https://datasheet.ciiva.com/11201/ds30041-11201864.pdf?src-supplier=Avnet; ComponentLink3Description: https://datasheet.ciiva.com/11201/ds30041-11201864.pdf?src-supplier=Avnet; ComponentLink4URL: https://datasheet.ciiva.com/16199/ds30041-16199045.pdf?src-supplier=Future+Electronics; ComponentLink4Description: https://datasheet.ciiva.com/16199/ds30041-16199045.pdf?src-supplier=Future+Electronics; ComponentLink5URL: https://datasheet.ciiva.com/11198/ds30041-11198965.pdf?src-supplier=Avnet; ComponentLink5Description: https://datasheet.ciiva.com/11198/ds30041-11198965.pdf?src-supplier=Avnet; ComponentLink6URL: https://datasheet.ciiva.com/972/ds30041-972551.pdf?src-supplier=Digi-Key; ComponentLink6Description: https://datasheet.ciiva.com/972/ds30041-972551.pdf?src-supplier=Digi-Key; ComponentLink7URL: https://datasheet.ciiva.com/972/ds30041-972552.pdf?src-supplier=Digi-Key; ComponentLink7Description: https://datasheet.ciiva.com/972/ds30041-972552.pdf?src-supplier=Digi-Key; ComponentLink8URL: https://datasheet.ciiva.com/972/ds30041-972550.pdf?src-supplier=Digi-Key; ComponentLink8Description: https://datasheet.ciiva.com/972/ds30041-972550.pdf?src-supplier=Digi-Key; Supplier Part Number 1: 1219442
R8 R10 = RC1206FR-074K7L: Res Thick Film 3.2 x 1.6 mm 4.7K Ohm 1% 0.25W(1/4W) 100ppm/ C Molded SMD Paper T/R; Manufacturer: Yageo; Voltage Rating (DC): 200V; Resistance: 4.7kR; Temperature Coefficient: 100ppm/°C; Power Rating: 250mW; Supplier 1: Arrow Electronics; Manufacturer Part Number: RC1206FR-074K7L; RoHS: Yes; Category: Chip SMD Resistors; Stock 1: 2350000; Pricing 1: 5000=0.00460 (USD); Case/Package: 1206; Number of Pins: 2; Case Code (Imperial): 1206; Case Code (Metric): 3216; Size Code: 1206; Min Operating Temperature: -55°C; Max Operating Temperature: 155°C; Tolerance: 1%; Packaging: Tape and Reel; Resistor Type: Thick Film; Voltage Rating: 200V; Package Quantity: 1; Termination: SMD/SMT; Number of Terminations: 2; Max Power Dissipation: 250mW; Features: Moisture Resistant; Series: RC; Resistance Tolerance: 1%; Construction: Rectangular; Length: 0.122inch; Width: 0.063inch; Height: 0.026inch; Depth: 1.6mm; REACH SVHC: Unknown; Lead Free: Lead Free; Military Standard: Not; RoHS Compliant: Yes; Supplier Part Number 1: RC1206FR-074K7L
R9 R11 = RC1206FR-07100RL: Res General Purpose Thick Film 1206 100 Ohm 1% 1/4W ±100ppm/°C Molded SMD Paper T/R; Manufacturer: Yageo; Power Rating: 250mW; Voltage Rating: 200V; Supplier 1: Arrow Electronics; Manufacturer Part Number: RC1206FR-07100RL; RoHS: Yes; Category: Chip SMD Resistors; Stock 1: 15950000; Pricing 1: 5000=0.00540, 10000=0.00450 (USD); Case/Package: 1206; Case Code (Imperial): 1206; Case Code (Metric): 3216; Size Code: 1206; Min Operating Temperature: -55°C; Max Operating Temperature: 155°C; Tolerance: 1%; Packaging: Tape and Reel; Resistance: 100R; Package Quantity: 5000; Termination: SMD/SMT; Resistor Type: Thick Film; Temperature Coefficient: 100ppm/°C; Features: Moisture Resistant; Series: RC; Max Power Dissipation: 250mW; Number of Terminations: 2; Resistance Tolerance: 1%; Technology: THICK FILM; Length: 3.1mm; Width: 1.6mm; Height: 0.55mm; Depth: 1.6mm; REACH SVHC: Unknown; Lead Free: Lead Free; RoHS Compliant: Yes; ComponentLink1URL: https://datasheet.ciiva.com/11808/0900766b80c6630a-11808606.pdf?src-supplier=RSComponents; ComponentLink1Description: https://datasheet.ciiva.com/11808/0900766b80c6630a-11808606.pdf?src-supplier=RSComponents; ComponentLink2URL: https://datasheet.ciiva.com/46445/444357-46445702.pdf?src-supplier=Element14; ComponentLink2Description: https://datasheet.ciiva.com/46445/444357-46445702.pdf?src-supplier=Element14; ComponentLink3URL: https://datasheet.ciiva.com/7857/444357-7857241.pdf?src-supplier=Element14; ComponentLink3Description: https://datasheet.ciiva.com/7857/444357-7857241.pdf?src-supplier=Element14; ComponentLink4URL: https://datasheet.ciiva.com/7857/444357-7857242.pdf?src-supplier=Element14; ComponentLink4Description: https://datasheet.ciiva.com/7857/444357-7857242.pdf?src-supplier=Element14; Supplier Part Number 1: RC1206FR-07100RL
R12 = RC1206FR-071ML: Res Thick Film 1206 1M Ohm 1% 0.25W(1/4W) ±100ppm/°C Epoxy Pad SMD T/R; Manufacturer: Yageo; Resistance: 1MR; Power Rating: 250mW; Voltage Rating: 200V; Supplier 1: Arrow Electronics; Manufacturer Part Number: RC1206FR-071ML; RoHS: Yes; Category: Chip SMD Resistors; Stock 1: 90000; Pricing 1: 5000=0.01560, 10000=0.01040, 25000=0.01030 (USD); Case/Package: 1206; Case Code (Imperial): 1206; Case Code (Metric): 3216; Size Code: 1206; Min Operating Temperature: -55°C; Max Operating Temperature: 155°C; Tolerance: 1%; Packaging: Tape and Reel; Temperature Coefficient: 100ppm/°C; Resistor Type: Thick Film; Package Quantity: 5000; Termination: SMD/SMT; Features: Moisture Resistant; Series: RC; Max Power Dissipation: 250mW; Number of Terminations: 2; Technology: THICK FILM; Resistance Tolerance: 1%; Construction: Rectangular; Length: 3.1mm; Width: 1.6mm; Height: 0.55mm; Depth: 1.6mm; REACH SVHC: Unknown; Lead Free: Lead Free; Military Standard: Not; RoHS Compliant: Yes; ComponentLink1URL: https://datasheet.ciiva.com/11819/0900766b80c6630a-11819912.pdf?src-supplier=RSComponents; ComponentLink1Description: https://datasheet.ciiva.com/11819/0900766b80c6630a-11819912.pdf?src-supplier=RSComponents; ComponentLink2URL: https://datasheet.ciiva.com/46445/444357-46445709.pdf?src-supplier=Element14; ComponentLink2Description: https://datasheet.ciiva.com/46445/444357-46445709.pdf?src-supplier=Element14; ComponentLink3URL: https://datasheet.ciiva.com/7857/444357-7857289.pdf?src-supplier=Element14; ComponentLink3Description: https://datasheet.ciiva.com/7857/444357-7857289.pdf?src-supplier=Element14; ComponentLink4URL: https://datasheet.ciiva.com/7857/444357-7857288.pdf?src-supplier=Element14; ComponentLink4Description: https://datasheet.ciiva.com/7857/444357-7857288.pdf?src-supplier=Element14; ComponentLink5URL: https://datasheet.ciiva.com/17033/pyu-rc1206-51-rohs-l-4-17033611.pdf?src-supplier=Future+Electronics; ComponentLink5Description: https://datasheet.ciiva.com/17033/pyu-rc1206-51-rohs-l-4-17033611.pdf?src-supplier=Future+Electronics; Supplier Part Number 1: RC1206FR-071ML
R13 = RC1206FR-071KL: as R56 on sheet modem; Supplier 1: Arrow Electronics; Manufacturer Part Number: RC1206FR-071KL; RoHS: Yes; Category: Chip SMD Resistors; Stock 1: 535000; Pricing 1: 5000=0.00940, 10000=0.00890 (USD); Case/Package: 1206; Case Code (Imperial): 1206; Case Code (Metric): 3216; Size Code: 1206; Min Operating Temperature: -55°C; Max Operating Temperature: 155°C; Tolerance: 1%; Packaging: Tape and Reel; Resistor Type: Thick Film; Termination: SMD/SMT; Series: RC; Resistance Tolerance: 1%; Construction: Rectangular; Technology: THICK FILM; Length: 3.1mm; Height: 0.55mm; Depth: 1.6mm; REACH SVHC: Unknown; Military Standard: Not; Lead Free: Lead Free; RoHS Compliant: Yes; ComponentLink1URL: https://datasheet.ciiva.com/11808/0900766b80c6630a-11808217.pdf?src-supplier=RSComponents; ComponentLink1Description: https://datasheet.ciiva.com/11808/0900766b80c6630a-11808217.pdf?src-supplier=RSComponents; ComponentLink2URL: https://datasheet.ciiva.com/29181/402540-da-01-en-smd-widerstand-chip1206-1-kohm-29181462.pdf?src-supplier=Conrad; ComponentLink2Description: https://datasheet.ciiva.com/29181/402540-da-01-en-smd-widerstand-chip1206-1-kohm-29181462.pdf?src-supplier=Conrad; ComponentLink3URL: https://datasheet.ciiva.com/46445/444357-46445708.pdf?src-supplier=Element14; ComponentLink3Description: https://datasheet.ciiva.com/46445/444357-46445708.pdf?src-supplier=Element14; Supplier Part Number 1: RC1206FR-071KL
R14 = RC1206FR-0710KL: as R57 on sheet modem; Supplier 1: Arrow Electronics; Manufacturer Part Number: RC1206FR-0710KL; RoHS: Yes; Category: Chip SMD Resistors; Stock 1: 10000; Pricing 1: 5000=0.00970 (USD); Case/Package: 1206; Case Code (Imperial): 1206; Case Code (Metric): 3216; Size Code: 1206; Min Operating Temperature: -55°C; Max Operating Temperature: 155°C; Tolerance: 1%; Packaging: Tape and Reel; Resistor Type: Thick Film; Package Quantity: 5000; Termination: SMD/SMT; Features: Moisture Resistant; Series: RC; Max Power Dissipation: 250mW; Number of Terminations: 2; Resistance Tolerance: 1%; Construction: Rectangular; Length: 3.1mm; Width: 1.6mm; Height: 0.55mm; Depth: 1.6mm; REACH SVHC: Unknown; Lead Free: Lead Free; Military Standard: Not; RoHS Compliant: Yes; ComponentLink1URL: https://datasheet.ciiva.com/46445/444357-46445703.pdf?src-supplier=Element14; ComponentLink1Description: https://datasheet.ciiva.com/46445/444357-46445703.pdf?src-supplier=Element14; ComponentLink2URL: https://datasheet.ciiva.com/7857/1692832-7857244.pdf?src-supplier=Element14; ComponentLink2Description: https://datasheet.ciiva.com/7857/1692832-7857244.pdf?src-supplier=Element14; ComponentLink3URL: https://datasheet.ciiva.com/7857/1692832-7857245.pdf?src-supplier=Element14; ComponentLink3Description: https://datasheet.ciiva.com/7857/1692832-7857245.pdf?src-supplier=Element14; Supplier Part Number 1: RC1206FR-0710KL
U2 = ENC28J60-I/SO: Stand-Alone Ethernet Controller with SPI Interface, 28-Pin SOIC, Industrial Temperature; ComponentLink1Description: Manufacturer URL; ComponentLink2Description: Datasheet; DatasheetVersion: revC, Jan-2008; ComponentLink3URL: http://www.microchip.com/stellent/groups/techpub_sg/documents/packagingspec/en012702.pdf; ComponentLink3Description: Package Specification; ComponentLink1URL: http://www.microchip.com/; Code_JEDEC: MS-013; RevisionNote: URLs added.; PackageVersion: revBB, Aug-2009; PackageDescription: 28-Lead Plastic Small Outline (SO) - Wide 7.50mm Body [SOIC]; ComponentLink2URL: http://ww1.microchip.com/downloads/en/DeviceDoc/39662c.pdf; PackageReference: SOIC-SO28; PartNumber: ENC28J60-I/SO; Supplier 1: RSComponents; Supplier Part Number 1: 6988987
Y2 = CRYSTAL 25.000MHZ: CRYSTAL 25.000MHZ 20PF THRU; Manufacturer: TXC; Manufacturer Part Number: 9B-8.000MBBK-B; Frequency Stability: 50ppm; Frequency: 8MHz; ESR (Equivalent Series Resistance): 80R; Supplier 1: Digi-Key; RoHS: Yes; Category: Crystals; Pricing 1: 1000=0.16000 (USD); Mount: Through Hole; Case/Package: Metal; Min Operating Temperature: -20°C; Max Operating Temperature: 70°C; Package Quantity: 1000; Frequency Tolerance: 50ppm; Load Capacitance: 20pF; Packaging: Bulk; Length: 0.453inch; Width: 0.197inch; Height: 0.145inch; ComponentLink1URL: https://datasheet.ciiva.com/6733/9b-6733750.pdf?src-supplier=Digi-Key; ComponentLink1Description: https://datasheet.ciiva.com/6733/9b-6733750.pdf?src-supplier=Digi-Key; ComponentLink2URL: https://datasheet.ciiva.com/29631/9b-29631174.pdf?src-supplier=Digi-Key; ComponentLink2Description: https://datasheet.ciiva.com/29631/9b-29631174.pdf?src-supplier=Digi-Key; Supplier Part Number 1: 887-2033-ND

## Nets that join several sheets
+5: rgb_card (C135.1 C136.1 D4.1 U24.1), rs485 (C81.1 C82.1 U18.8), hub75d (27 pins), power (7 pins), phy (C101.1 C102.1 Q3.2 R31.2)
ETH_VCC: wifi (7 pins), phy (31 pins), ethernet (11 pins)
GND: rgb_card (65 pins), rs485 (C81.2 C82.2 J5.1 U18.5), memory (12 pins), wifi (6 pins), hub75d (63 pins), power (24 pins), phy (29 pins), rtc (12 pins), modem (36 pins), ethernet (20 pins)
VBAT: power (7 pins), modem (14 pins)
VCC: rgb_card (53 pins), rs485 (R15.2 R45.2 R46.2), memory (12 pins), power (C75.1 C76.1 U16.2 U16.4), rtc (6 pins), ethernet (R9.1 R11.1)
VRTC: rtc (J2.1 U22.14), modem (U23.28)
DATA0: rgb_card (U1.1), hub75d (P10.2 U4.18)
DATA1: rgb_card (U1.2), hub75d (P10.1 U4.17)
DATA2: rgb_card (U1.3), hub75d (P10.4 U4.16)
DATA3: rgb_card (U1.4), hub75d (P10.3 U4.15)
DATA4: rgb_card (U1.5), hub75d (P10.6 U4.14)
DATA5: rgb_card (U1.10), hub75d (P10.5 U4.13)
DATA6: rgb_card (U1.11), hub75d (P10.8 U4.12)
DATA7: rgb_card (U1.12), hub75d (P10.7 U4.11)
DATA8: rgb_card (U1.13), hub75d (P10.10 U6.18)
DATA9: rgb_card (U1.14), hub75d (P10.9 U6.17)
DATA10: rgb_card (U1.15), hub75d (P10.12 U6.16)
DATA11: rgb_card (U1.18), hub75d (P10.11 U6.15)
DATA12: rgb_card (U1.19), hub75d (P10.14 U6.14)
DATA13: rgb_card (U1.20), hub75d (P10.13 U6.13)
DATA14: rgb_card (U1.21), hub75d (P10.16 U6.12)
DATA15: rgb_card (U1.22), hub75d (P10.15 U6.11)
DATA16: rgb_card (U1.49), hub75d (P10.25 U8.18)
DATA17: rgb_card (U1.50), hub75d (P10.26 U8.17)
DATA18: rgb_card (U1.53), hub75d (P10.27 U8.16)
DATA19: rgb_card (U1.54), hub75d (P10.28 U8.15)
DATA20: rgb_card (U1.55), hub75d (P10.29 U8.14)
DATA21: rgb_card (U1.58), hub75d (P10.30 U8.13)
DATA22: rgb_card (U1.59), hub75d (P10.31 U8.12)
DATA23: rgb_card (U1.60), hub75d (P10.32 U8.11)
DATA24: rgb_card (U1.63), hub75d (P10.33 U10.18)
DATA25: rgb_card (U1.64), hub75d (P10.34 U10.17)
DATA26: rgb_card (U1.65), hub75d (P10.35 U10.16)
DATA27: rgb_card (U1.66), hub75d (P10.36 U10.15)
DATA28: rgb_card (U1.67), hub75d (P10.37 U10.14)
DATA29: rgb_card (U1.68), hub75d (P10.38 U10.13)
DIR: rgb_card (U1.135), rs485 (R15.1 U18.2 U18.3)
DMD_A: rgb_card (U1.40), hub75d (6 pins)
DMD_B: rgb_card (U1.46), hub75d (6 pins)
DMD_C: rgb_card (U1.47), hub75d (6 pins)
DMD_CLK: rgb_card (U1.42), hub75d (6 pins)
DMD_D: rgb_card (U1.48), hub75d (6 pins)
DMD_OE: rgb_card (U1.37), hub75d (6 pins)
DMD_STB: rgb_card (U1.41), hub75d (6 pins)
ESP32_RXD: rgb_card (U1.77), wifi (R17.2)
ESP32_TXD: rgb_card (U1.78), wifi (R18.2)
ETH_CRS_DEV: rgb_card (U1.43), phy (R22.1)
ETH_MDC: rgb_card (U1.27), phy (U20.13)
ETH_MDIO: rgb_card (U1.36), phy (R25.2 U20.12)
ETH_POWER: rgb_card (U1.26), phy (R32.1)
ETH_REF_CLK: rgb_card (U1.35), phy (R19.2)
ETH_RXD0: rgb_card (U1.44), phy (R24.2)
ETH_RXD1: rgb_card (U1.45), phy (R23.2)
ETH_TX_EN: rgb_card (U1.126), phy (U20.16)
ETH_TXD0: rgb_card (U1.128), phy (U20.17)
ETH_TXD1: rgb_card (U1.129), phy (U20.18)
MDM_DTR: rgb_card (U1.140), modem (R44.2)
MDM_REG_CTRL: rgb_card (U1.91), power (R50.1)
MDM_RI: rgb_card (U1.139), modem (R41.2)
MDM_RXD: rgb_card (U1.122), modem (R43.2)
MDM_RXD1: rgb_card (U1.113), modem (R61.2)
MDM_STATUS: rgb_card (U1.133), modem (R42.2)
MDM_TXD: rgb_card (U1.119), modem (R30.2)
MDM_TXD1: rgb_card (U1.116), modem (R55.2)
MEM_CS1: rgb_card (U1.73), memory (U12.1)
MEM_CS2: rgb_card (U1.80), memory (U13.1)
MEM_CS3: rgb_card (U1.79), memory (U14.1)
MEM_CS4: rgb_card (U1.87), memory (U15.1)
MEM_MISO: rgb_card (U1.75), memory (U12.5 U13.5 U14.5 U15.5)
MEM_MOSI: rgb_card (U1.76), memory (U12.2 U13.2 U14.2 U15.2)
MEM_SCK: rgb_card (U1.74), memory (U12.6 U13.6 U14.6 U15.6)
RS485_RXD: rgb_card (P3.1 U1.136), rs485 (R46.1 U18.4)
RS485_TXD: rgb_card (P3.2 U1.137), rs485 (R45.1 U18.1)
RTC_INT: rgb_card (U1.86), rtc (R38.1 U22.3)
RTC_SCL: rgb_card (U1.69), rtc (R39.1 U22.16)
RTC_SDA: rgb_card (U1.70), rtc (R40.1 U22.15)